# Altium schematic sheet schematic.SchDoc
size A4; SheetNumber: 1; SheetTotal: 1; SPICEModelCacheEHAOFZEF: <root> / <DocumentId>EHAOFZEF</DocumentId> / <CacheFrame Number="0"> / <Model Name="n7002" Kind="CKT"> / <Text>*---------- 2N7002 Spice Model ---------- / .SUBCKT N7002 10 20 30 / *     TERMINALS:  D  G  S / M1 1 2 3 3 NMOS L = 1E-006 W = 1E-006 / RD 10 1 0.976 / RS 30 3 0.001 / RG 20 2 160.6 / CGS 2 3 2E-011 / EGD 12 0 2 1 1 / VFB 14 0 0 / FFB 2 1 VFB 1 / CGD 13 14 5.9E-011 / R1 13 0 1 / D1 12 13 DLIM / DDG 15 14 DCGD / R2 12 15 1 / D2 15 0 DLIM / DSD 3 10 DSUB / .MODEL NMOS NMOS LEVEL = 3 VMAX = 1E+006 ETA = 0 VTO = 1.3 / + TOX = 6E-008 NSUB = 1E+016 KP = 0.4654 KAPPA = 1E-015 U0 = 400 / .MODEL DCGD D CJO = 1.2E-011 VJ = 0.6 M = 0.6 / .MODEL DSUB D IS = 6.808E-010 N = 1.576 RS = 0.1408 BV = 72 CJO = 8E-012 VJ = 0.8 M = 0.6474 / .MODEL DLIM D IS = 0.0001 / .ENDS</Text> / </Model> / <Model Name="2n2222" Kind="MDL"> / <Text>****** / * Spice Model / * Item: 2N2222 / * Date: 5/06/2014 / * Revision History: A / *========================================================== / * This model was developed by: / * Central Semiconductor Corp. / * 145 Adams Avenue / * Hauppauge, NY 11788 / * / * These models are subject to change without notice. / * Users may not directly or indirectly re-sell or / * re-distribute this model. This model may not / * be modified, or altered without the consent of Central Semiconductor Corp. / * / * For more information on this model contact / * Central Semiconductor Corp. at: / * (631) 435-1110 or Engineering@centralsemi.com / * http://www.centralsemi.com / *========================================================== / ****** / *SRC=2N2222;2N2222;BJTs NPN; Si;  60V  0.800A  250MHz   Central Semi Central Semi / .MODEL 2N2222  NPN (IS=2.20f NF=1.00 BF=240 VAF=114 / + IKF=0.293 ISE=2.73p NE=2.00 BR=4.00 NR=1.00 / + VAR=24.0 IKR=0.600 RE=0.194 RB=0.777 RC=77.7m / + XTB=1.5 CJE=24.9p VJE=1.10 MJE=0.500 CJC=12.4p VJC=0.300 / + MJC=0.300 TF=371p TR=64.0n EG=1.12 )</Text> / </Model> / <Model Name="led1" Kind="MDL"> / <Text>*Typ RED GaAs LED: Vf=1.7V Vr=4V If=40mA trr=3uS / *LED Pinout: 1=A, 2=K / .MODEL LED1 D (IS=93.2P RS=42M N=3.73 BV=4 IBV=10U / + CJO=2.97P VJ=.75 M=.333 TT=4.32U)</Text> / </Model> / <Model Name="vnse_0" Kind="CKT"> / <Text>.SUBCKT VNSE_0  1 2 / .PARAM FLW=10 / .PARAM NLF=80 / .PARAM NVR=35 / .PARAM GLF={PWR(FLW,0.25)*NLF/1164} / .PARAM RNV={1.184*PWR(NVR,2)} / .MODEL DVN D KF={PWR(FLW,0.5)/1E11} IS=1.0E-16 / I1 0 7 10E-3 / I2 0 8 10E-3 / D1 7 0 DVN / D2 8 0 DVN / E1 3 6 7 8 {GLF} / R1 3 0 1E9 / R2 3 0 1E9 / R3 3 6 1E9 / E2 6 4 5 0 10 / R4 5 0 {RNV} / R5 5 0 {RNV} / R6 3 4 1E9 / R7 4 0 1E9 / E3 1 2 3 4 1 / .ENDS</Text> / </Model> / <Model Name="phaserev_0" Kind="CKT"> / <Text>* / .SUBCKT PHASEREV_0  VCC VEE VIN+ VIN- VOUT+ VOUT- MID / E1 VOUT+ MID VALUE={IF(V(VIN+,MID)&lt;V(VEE,MID)-0.3,V(VCC,MID),V(VIN+,MID))} / E2 VOUT- MID VALUE={IF(V(VIN-,MID)&lt;V(VEE,MID)-0.3,V(VCC,MID),V(VIN-,MID))} / .ENDS</Text> / </Model> / <Model Name="crs_dist_0" Kind="CKT"> / <Text>.SUBCKT CRS_DIST_0  VIMON MID OUT / V1 VREF MID -40M / ESHF VSHF MID VIMON VREF 1 / GZC MID ZC VALUE = {SGN(V(VSHF,MID))} / R1 ZC MID 1 / C1 ZC MID 2U / GCR MID OUT VALUE = {IF((ABS(V(ZC,MID))&lt;=0.9),0,1)} / R2 OUT MID 1 / .ENDS</Text> / </Model> / <Model Name="vccs_lim_1_0" Kind="CKT"> / <Text>.SUBCKT VCCS_LIM_1_0  VC+ VC- IOUT+ IOUT- / .PARAM GAIN = 1E-4 / .PARAM IPOS = .5 / .PARAM INEG = -.5 / G1 IOUT+ IOUT- VALUE={LIMIT(GAIN*V(VC+,VC-),INEG,IPOS)} / .ENDS</Text> / </Model> / <Model Name="vccs_lim_zo_0" Kind="CKT"> / <Text>.SUBCKT VCCS_LIM_ZO_0  VC+ VC- IOUT+ IOUT- / .PARAM GAIN = 4E3 / .PARAM IPOS = 1E6 / .PARAM INEG = -1E6 / G1 IOUT+ IOUT- VALUE={LIMIT(GAIN*V(VC+,VC-),INEG,IPOS)} / .ENDS</Text> / </Model> / <Model Name="vccs_lim_2_en_0" Kind="CKT"> / <Text>.SUBCKT VCCS_LIM_2_EN_0  VC+ VC- IOUT+ IOUT- EN MID / .PARAM GAIN = 8.4E-4 / .PARAM IPOS = 0.005 / .PARAM INEG = -0.005 / G1 IOUT+ IOUT- VALUE={LIMIT(GAIN*V(EN,MID)*V(VC+,VC-),INEG,IPOS)} / .ENDS</Text> / </Model> / <Model Name="femt_0" Kind="CKT"> / <Text>.SUBCKT FEMT_0  1 2 / .PARAM FLWF=1E-3 / .PARAM NLFF=500 / .PARAM NVRF=500 / .PARAM GLFF={PWR(FLWF,0.25)*NLFF/1164} / .PARAM RNVF={1.184*PWR(NVRF,2)} / .MODEL DVNF D KF={PWR(FLWF,0.5)/1E11} IS=1.0E-16 / I1 0 7 10E-3 / I2 0 8 10E-3 / D1 7 0 DVNF / D2 8 0 DVNF / E1 3 6 7 8 {GLFF} / R1 3 0 1E9 / R2 3 0 1E9 / R3 3 6 1E9 / E2 6 4 5 0 10 / R4 5 0 {RNVF} / R5 5 0 {RNVF} / R6 3 4 1E9 / R7 4 0 1E9 / G1 1 2 3 4 1E-6 / .ENDS</Text> / </Model> / <Model Name="vccs_limit_iq_0" Kind="CKT"> / <Text>.SUBCKT VCCS_LIMIT_IQ_0  VC+ VC- IOUT+ IOUT- / .PARAM GAIN = 1E-3 / G1 IOUT- IOUT+ VALUE={IF( (V(VC+,VC-)&lt;=0),0,GAIN*V(VC+,VC-) )} / .ENDS</Text> / </Model> / <Model Name="clamp_amp_lo_0" Kind="CKT"> / <Text>.SUBCKT CLAMP_AMP_LO_0  VC+ VC- VIN COM VO+ VO- / .PARAM G=1 / GVO+ COM VO+ VALUE = {IF(V(VIN,COM)&gt;V(VC+,COM),((V(VIN,COM)-V(VC+,COM))*G),0)} / GVO- COM VO- VALUE = {IF(V(VIN,COM)&lt;V(VC-,COM),((V(VC-,COM)-V(VIN,COM))*G),0)} / .ENDS</Text> / </Model> / <Model Name="vccs_ext_lim_0" Kind="CKT"> / <Text>.SUBCKT VCCS_EXT_LIM_0  VIN+ VIN- IOUT- IOUT+ VP+ VP- / .PARAM GAIN = 1 / G1 IOUT+ IOUT- VALUE={LIMIT(GAIN*V(VIN+,VIN-),V(VP-,VIN-), V(VP+,VIN-))} / .ENDS</Text> / </Model> / <Model Name="clamp_amp_hi_0" Kind="CKT"> / <Text>.SUBCKT CLAMP_AMP_HI_0  VC+ VC- VIN COM VO+ VO- / .PARAM G=10 / GVO+ COM VO+ VALUE = {IF(V(VIN,COM)&gt;V(VC+,COM),((V(VIN,COM)-V(VC+,COM))*G),0)} / GVO- COM VO- VALUE = {IF(V(VIN,COM)&lt;V(VC-,COM),((V(VC-,COM)-V(VIN,COM))*G),0)} / .ENDS</Text> / </Model> / <Model Name="vccs_lim_gr_0" Kind="CKT"> / <Text>.SUBCKT VCCS_LIM_GR_0  VC+ VC- IOUT+ IOUT- / .PARAM GAIN = 1 / .PARAM IPOS = 0.013 / .PARAM INEG = -0.013 / G1 IOUT+ IOUT- VALUE={LIMIT(GAIN*V(VC+,VC-),INEG,IPOS)} / .ENDS</Text> / </Model> / <Model Name="vccs_lim_4_0" Kind="CKT"> / <Text>.SUBCKT VCCS_LIM_4_0  VC+ VC- IOUT+ IOUT- / .PARAM GAIN = 1 / .PARAM IPOS = 1.04 / .PARAM INEG = -1.04 / G1 IOUT+ IOUT- VALUE={LIMIT(GAIN*V(VC+,VC-),INEG,IPOS)} / .ENDS</Text> / </Model> / <Model Name="vccs_lim_claw+_0" Kind="CKT"> / <Text>.SUBCKT VCCS_LIM_CLAW+_0  VC+ VC- IOUT+ IOUT- / G1 IOUT+ IOUT- TABLE {ABS(V(VC+,VC-))} = / +(0, 1.17E-03) / +(0.0046251, 1.17E-3) / +(0.15716, 1.21E-3) / +(1.3309, 1.28E-3) / +(35.075, 2.12E-3) / +(35.680, 2.55E-3) / +(36.033, 2.84E-3) / +(37.416, 7.97E-3) / .ENDS</Text> / </Model> / <Model Name="vccs_lim_claw-_0" Kind="CKT"> / <Text>.SUBCKT VCCS_LIM_CLAW-_0  VC+ VC- IOUT+ IOUT- / G1 IOUT+ IOUT- TABLE {ABS(V(VC+,VC-))} = / +(0.010, 2.50E-5) / +(0.070, 2.50E-5) / +(0.090, 5.80E-4) / +(0.100, 6.06E-4) / +(0.760, 7.14E-4) / +(1.440, 7.62E-4) / +(8.000, 1.10E-3) / +(13.60, 1.55E-3) / +(15.45, 1.75E-3) / +(17.26, 2.15E-3) / +(18.87, 2.94E-3) / +(21.58, 4.50E-3) / +(25.53, 1.02E-2) / .ENDS</Text> / </Model> / <Model Name="vccs_lim_3_0" Kind="CKT"> / <Text>.SUBCKT VCCS_LIM_3_0  VC+ VC- IOUT+ IOUT- / .PARAM GAIN = 1 / .PARAM IPOS = 0.435 / .PARAM INEG = -0.435 / G1 IOUT+ IOUT- VALUE={LIMIT(GAIN*V(VC+,VC-),INEG,IPOS)} / .ENDS</Text> / </Model> / <Model Name="ol_sense_0" Kind="CKT"> / <Text>.SUBCKT OL_SENSE_0  COM SW+ OLN  OLP / GSW+ COM SW+ VALUE = {IF((V(OLN,COM)&gt;10E-3 | V(OLP,COM)&gt;10E-3),1,0)} / .ENDS</Text> / </Model> / <Model Name="lmx58_lm2904" Kind="CKT"> / <Text>* LMX58_LM2904 - Rev. B / * Created by Paul Goedeke; November 16, 2018 - Revised by GPAMPS Team; 2021-06-29 / * Created with Green-Williams-Lis Op Amp Macro-model Architecture / * Copyright 2018 by Texas Instruments Corporation / ****************************************************** / * MACRO-MODEL SIMULATED PARAMETERS: / ****************************************************** / * OPEN-LOOP GAIN AND PHASE VS. FREQUENCY  WITH RL, CL EFFECTS (Aol) / * UNITY GAIN BANDWIDTH (GBW) / * INPUT COMMON-MODE REJECTION RATIO VS. FREQUENCY (CMRR) / * POWER SUPPLY REJECTION RATIO VS. FREQUENCY (PSRR) / * DIFFERENTIAL INPUT IMPEDANCE (Zid) / * COMMON-MODE INPUT IMPEDANCE (Zic) / * OPEN-LOOP OUTPUT IMPEDANCE VS. FREQUENCY (Zo) / * OUTPUT CURRENT THROUGH THE SUPPLY (Iout) / * INPUT VOLTAGE NOISE DENSITY VS. FREQUENCY (en) / * INPUT CURRENT NOISE DENSITY VS. FREQUENCY (in) / * OUTPUT VOLTAGE SWING vs. OUTPUT CURRENT (Vo) / * SHORT-CIRCUIT OUTPUT CURRENT (Isc) / * QUIESCENT CURRENT (Iq) / * SETTLING TIME VS. CAPACITIVE LOAD (ts) / * SLEW RATE (SR) / * SMALL SIGNAL OVERSHOOT VS. CAPACITIVE LOAD / * LARGE SIGNAL RESPONSE / * OVERLOAD RECOVERY TIME (tor) / * INPUT BIAS CURRENT (Ib) / * INPUT OFFSET CURRENT (Ios) / * INPUT OFFSET VOLTAGE (Vos) / * INPUT COMMON-MODE VOLTAGE RANGE (Vcm) / * INPUT OFFSET VOLTAGE VS. INPUT COMMON-MODE VOLTAGE (Vos vs. Vcm) / * INPUT/OUTPUT ESD CELLS (ESDin, ESDout) / ****************************************************** / .subckt LMX58_LM2904 IN+ IN- VCC VEE OUT / ****************************************************** / * MODEL DEFINITIONS: / .model BB_SW VSWITCH(Ron=50 Roff=1e12 Von=700e-3 Voff=0) / .model ESD_SW VSWITCH(Ron=50 Roff=1e12 Von=250e-3 Voff=0) / .model OL_SW VSWITCH(Ron=1e-3 Roff=1e9 Von=900e-3 Voff=800e-3) / .model OR_SW VSWITCH(Ron=10e-3 Roff=1e9 Von=1e-3 Voff=0) / .model R_NOISELESS RES(T_ABS=-273.15) / ****************************************************** / I_OS        ESDn MID -18N / I_B         37 MID -20N / V_GRp       57 MID 180 / V_GRn       58 MID -180 / V_ISCp      51 MID 40 / V_ISCn      52 MID -40 / V_ORn       45 VCLP -1.2 / V11         56 44 0 / V_ORp       43 VCLP 1.2 / V12         55 42 0 / V4          33 OUT 0 / VCM_MIN     79 VEE_B 0 / VCM_MAX     80 VCC_B -1.5 / I_Q         VCC VEE 350U / V_OS        86 37 1.8M / R61         MID 22 R_NOISELESS 8.001K / C16         22 23 19.89P / R58         23 22 R_NOISELESS 100MEG / GVCCS2      23 MID VEE_B MID  -992.9M / R57         MID 23 R_NOISELESS 1 / XU3         VCC_B VEE_B 24 25 26 27 MID PHASEREV_0 / XU1         VIMON MID CRS CRS_DIST_0 / C21         28 29 313.8N / C22         30 31 636.6F / R70         31 MID R_NOISELESS 2.5 / R67         31 30 R_NOISELESS 10K / R66         30 MID R_NOISELESS 1 / XU2         31 MID MID 32 VCCS_LIM_ZO_0 / GVCCS4      30 MID 29 MID  -4.3 / R65         29 MID R_NOISELESS 3.03K / R64         29 28 R_NOISELESS 10K / R63         28 MID R_NOISELESS 1 / GVCCS3      28 MID CL_CLAMP 33  -90 / R62         32 MID R_NOISELESS 1 / C29         34 MID 72F / R78         MID 34 R_NOISELESS 1MEG / GVCCS9      34 MID 35 MID  -1U / XU5         36 MID MID CLAMP CRS MID VCCS_LIM_2_EN_0 / C28         38 MID 1P / R77         39 38 R_NOISELESS 100 / C27         40 MID 1P / R76         41 40 R_NOISELESS 100 / R75         MID 42 R_NOISELESS 1 / GVCCS8      42 MID 43 MID  -1 / R74         44 MID R_NOISELESS 1 / GVCCS7      44 MID 45 MID  -1 / Xi_nn       ESDn MID FEMT_0 / Xi_np       MID 37 FEMT_0 / Xe_n        ESDp 37 VNSE_0 / C25         35 MID 72F / R69         MID 35 R_NOISELESS 1MEG / GVCCS6      35 MID VSENSE MID  -1U / C20         CLAMP MID 13.5N / R68         MID CLAMP R_NOISELESS 1MEG / R44         MID 36 R_NOISELESS 1MEG / XVCCS_LIM_1 46 27 MID 36 VCCS_LIM_1_0 / Rdummy      MID 33 R_NOISELESS 25K / Rx          33 32 R_NOISELESS 250K / R56         MID 47 R_NOISELESS 1K / C15         47 48 1.592P / R55         48 47 R_NOISELESS 100MEG / GVCCS1      48 MID VCC_B MID  -100M / R54         MID 48 R_NOISELESS 1 / R49         MID 49 R_NOISELESS 4.616K / C14         49 50 26.53P / R48         50 49 R_NOISELESS 100MEG / G_adjust    50 MID ESDp MID  -685.2M / Rsrc        MID 50 R_NOISELESS 1 / XIQPos      VIMON MID MID VCC VCCS_LIMIT_IQ_0 / XIQNeg      MID VIMON VEE MID VCCS_LIMIT_IQ_0 / C_DIFF      ESDp ESDn 1P / XCL_AMP     51 52 VIMON MID 53 54 CLAMP_AMP_LO_0 / SOR_SWp     CLAMP 55 CLAMP 55  S_VSWITCH_1 / SOR_SWn     56 CLAMP 56 CLAMP  S_VSWITCH_2 / XGR_AMP     57 58 59 MID 60 61 CLAMP_AMP_HI_0 / R39         57 MID R_NOISELESS 1T / R37         58 MID R_NOISELESS 1T / R42         VSENSE 59 R_NOISELESS 1M / C19         59 MID 1F / R38         60 MID R_NOISELESS 1 / R36         MID 61 R_NOISELESS 1 / R40         60 62 R_NOISELESS 1M / R41         61 63 R_NOISELESS 1M / C17         62 MID 1F / C18         MID 63 1F / XGR_SRC     62 63 CLAMP MID VCCS_LIM_GR_0 / R21         53 MID R_NOISELESS 1 / R20         MID 54 R_NOISELESS 1 / R29         53 64 R_NOISELESS 1M / R30         54 65 R_NOISELESS 1M / C9          64 MID 1F / C8          MID 65 1F / XCL_SRC     64 65 CL_CLAMP MID VCCS_LIM_4_0 / R22         51 MID R_NOISELESS 1T / R19         MID 52 R_NOISELESS 1T / XCLAWp      VIMON MID 66 VCC_B VCCS_LIM_CLAW+_0 / XCLAWn      MID VIMON VEE_B 67 VCCS_LIM_CLAW-_0 / R12         66 VCC_B R_NOISELESS 1K / R16         66 68 R_NOISELESS 1M / R13         VEE_B 67 R_NOISELESS 1K / R17         69 67 R_NOISELESS 1M / C6          69 MID 1F / C5          MID 68 1F / G2          VCC_CLP MID 68 MID  -1M / R15         VCC_CLP MID R_NOISELESS 1K / G3          VEE_CLP MID 69 MID  -1M / R14         MID VEE_CLP R_NOISELESS 1K / XCLAW_AMP   VCC_CLP VEE_CLP VOUT_S MID 70 71 CLAMP_AMP_LO_0 / R26         VCC_CLP MID R_NOISELESS 1T / R23         VEE_CLP MID R_NOISELESS 1T / R25         70 MID R_NOISELESS 1 / R24         MID 71 R_NOISELESS 1 / R27         70 72 R_NOISELESS 1M / R28         71 73 R_NOISELESS 1M / C11         72 MID 1F / C10         MID 73 1F / XCLAW_SRC   72 73 CLAW_CLAMP MID VCCS_LIM_3_0 / H2          41 MID V11 -1 / H3          39 MID V12 1 / C12         SW_OL MID 100P / R32         74 SW_OL R_NOISELESS 100 / R31         74 MID R_NOISELESS 1 / XOL_SENSE   MID 74 40 38 OL_SENSE_0 / S1          28 29 SW_OL MID  S_VSWITCH_3 / H1          75 MID V4 1K / S7          VEE OUT VEE OUT  S_VSWITCH_4 / S6          OUT VCC OUT VCC  S_VSWITCH_5 / R11         MID 76 R_NOISELESS 1T / R18         76 VOUT_S R_NOISELESS 100 / C7          VOUT_S MID 10P / E5          76 MID OUT MID  1 / C13         VIMON MID 10P / R33         75 VIMON R_NOISELESS 100 / R10         MID 75 R_NOISELESS 1T / R47         77 VCLP R_NOISELESS 100 / C24         VCLP MID 100P / E4          77 MID CL_CLAMP MID  1 / R46         MID CL_CLAMP R_NOISELESS 1K / G9          CL_CLAMP MID CLAW_CLAMP MID  -1M / R45         MID CLAW_CLAMP R_NOISELESS 1K / G8          CLAW_CLAMP MID 34 MID  -1M / R43         MID VSENSE R_NOISELESS 1K / G15         VSENSE MID CLAMP MID  -1M / C4          46 MID 1F / R9          46 78 R_NOISELESS 1M / R7          MID 79 R_NOISELESS 1T / R6          80 MID R_NOISELESS 1T / R8          MID 78 R_NOISELESS 1 / XVCM_CLAMP  26 MID 78 MID 80 79 VCCS_EXT_LIM_0 / E1          MID 0 81 0  1 / R89         VEE_B 0 R_NOISELESS 1 / R5          82 VEE_B R_NOISELESS 1M / C3          82 0 1F / R60         81 82 R_NOISELESS 1MEG / C1          81 0 100e-9 / R3          81 0 R_NOISELESS 1T / R59         83 81 R_NOISELESS 1MEG / C2          83 0 1F / R4          VCC_B 83 R_NOISELESS 1M / R88         VCC_B 0 R_NOISELESS 1 / G17         VEE_B 0 VEE 0  -1 / G16         VCC_B 0 VCC 0  -1 / R_PSR       84 24 R_NOISELESS 1K / G_PSR       24 84 47 22  -1M / R2          25 ESDn R_NOISELESS 1M / R1          84 85 R_NOISELESS 1M / R_CMR       86 85 R_NOISELESS 1K / G_CMR       85 86 49 MID  -1M / C_CMn       ESDn MID 2P / C_CMp       MID ESDp 2P / R53         ESDn MID R_NOISELESS 1T / R52         MID ESDp R_NOISELESS 1T / R35         IN- ESDn R_NOISELESS 10M / R34         IN+ ESDp R_NOISELESS 10M / .MODEL S_VSWITCH_1 VSWITCH (RON=10M ROFF=1T VON=10M VOFF=0) / .MODEL S_VSWITCH_2 VSWITCH (RON=10M ROFF=1T VON=10M VOFF=0) / .MODEL S_VSWITCH_3 VSWITCH (RON=1M ROFF=1T VON=500M VOFF=100M) / .MODEL S_VSWITCH_4 VSWITCH (RON=50 ROFF=1T VON=500M VOFF=450M) / .MODEL S_VSWITCH_5 VSWITCH (RON=50 ROFF=1T VON=500M VOFF=450M) / .ENDS LMX58_LM2904</Text> / <Dependency>0\vnse_0</Dependency> / <Dependency>0\phaserev_0</Dependency> / <Dependency>0\crs_dist_0</Dependency> / <Dependency>0\vccs_lim_1_0</Dependency> / <Dependency>0\vccs_lim_zo_0</Dependency> / <Dependency>0\vccs_lim_2_en_0</Dependency> / <Dependency>0\femt_0</Dependency> / <Dependency>0\vccs_limit_iq_0</Dependency> / <Dependency>0\clamp_amp_lo_0</Dependency> / <Dependency>0\vccs_ext_lim_0</Dependency> / <Dependency>0\clamp_amp_hi_0</Dependency> / <Dependency>0\vccs_lim_gr_0</Dependency> / <Dependency>0\vccs_lim_4_0</Dependency> / <Dependency>0\vccs_lim_claw+_0</Dependency> / <Dependency>0\vccs_lim_claw-_0</Dependency> / <Dependency>0\vccs_lim_3_0</Dependency> / <Dependency>0\ol_sense_0</Dependency> / </Model> / <Model Name="led3" Kind="MDL"> / <Text>*Typ BLUE SiC LED: Vf=3.4V Vr=5V If=40mA trr=3uS / *LED Pinout: 1=A, 2=K / .MODEL LED3 D (IS=93.1P RS=42M N=7.47 BV=5 IBV=30U / + CJO=2.97P VJ=.75 M=.333 TT=4.32U)</Text> / </Model> / <Model Name="bs170" Kind="CKT"> / <Text>.SUBCKT BS170 1 2 3 / * 1=drain  2=gate  3=source / Cgs  2 3 12.3E-12 / Cgd1 2 4 27.4E-12 / Cgd2 1 4 6E-12 / M1 1 2 3 3 MOST1 / M2 4 2 1 3 MOST2 / D1 3 1 Dbody / .MODEL MOST1 NMOS(Level=3 Kp=20.78u W=9.7m L=2u Rs=20m Vto=2 Rd=1.186) / .MODEL MOST2 NMOS(VTO=-4.73 Kp=20.78u W=9.7m L=2u Rs=20m) / .MODEL Dbody D(Is=125f N=1.023 Rs=1.281 Ikf=18.01 Cjo=46.3p M=.3423 / +            Vj=.4519 Bv=60 Ibv=10u Tt=161.6n) / .ENDS</Text> / </Model> / <Model Name="npn" Kind="MDL"> / <Text>*Default NPN BJT / *NPN Trans Pinout: C,B,E / .MODEL NPN NPN()</Text> / </Model> / </CacheFrame> / </root>
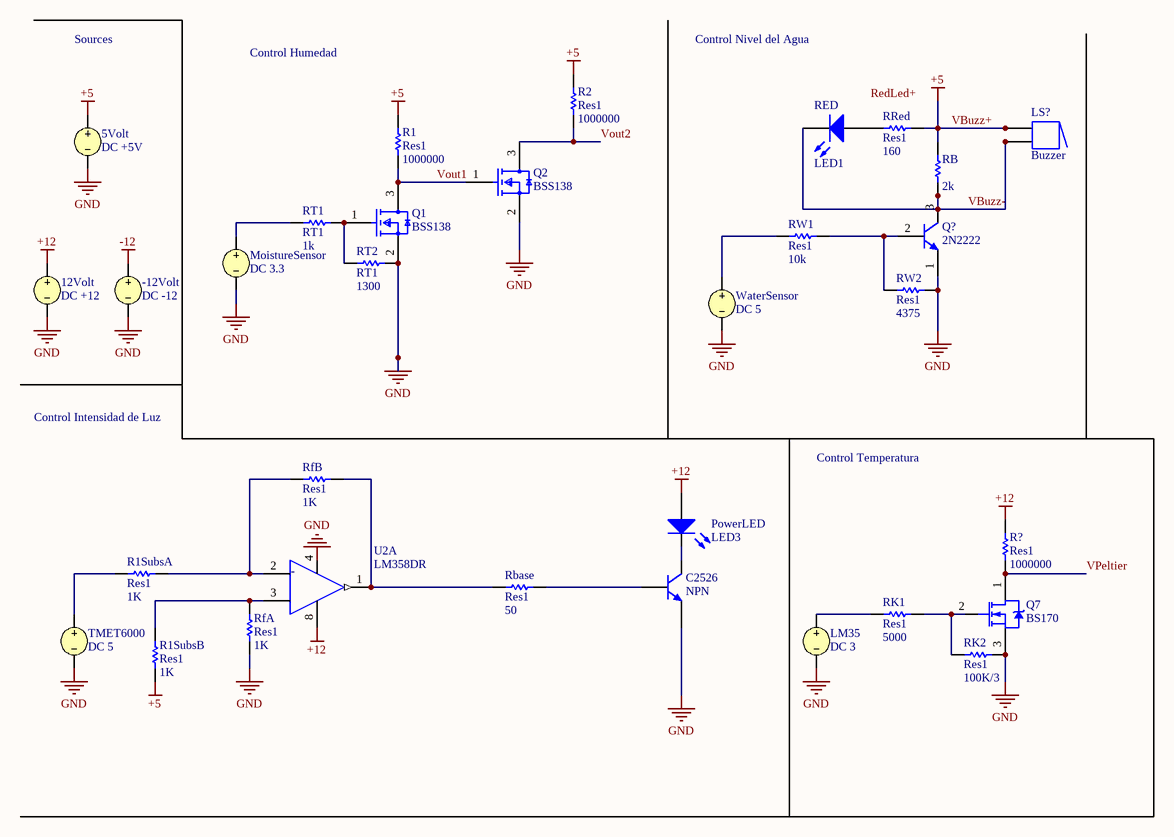
[diagram p0: schematic.SchDoc]

## Parts
5Volt  DC +5V
12Volt  DC +12
-12Volt  DC -12
C2526  NPN  [TO-226-AA]
LM35  DC 3
LS?  Buzzer  [ABSM-1574]
MoistureSensor  DC 3.3
PowerLED  LED3  [3.5X2.8X1.9]
Q1  BSS138  [FP-318-08-IPC_B]
Q2  BSS138  [FP-318-08-IPC_B]
Q7  BS170  [ONSC-TO-92-3-29-11]
Q?  2N2222  [MLTC-TO-18-3]
R1  Res1  value 1000000  [AXIAL-0.3]
R1SubsA  Res1  value 1K  [AXIAL-0.3]
R1SubsB  Res1  value 1K  [AXIAL-0.3]
R2  Res1  value 1000000  [AXIAL-0.3]
R?  Res1  value 1000000  [AXIAL-0.3]
RB  value 2k  [AXIAL-0.3]
Rbase  Res1  value 50  [AXIAL-0.3]
RED  LED1  [LED-1]
RfA  Res1  value 1K  [AXIAL-0.3]
RfB  Res1  value 1K  [AXIAL-0.3]
RK1  Res1  value 5000  [AXIAL-0.3]
RK2  Res1  value 100K/3  [AXIAL-0.3]
RRed  Res1  value 160  [AXIAL-0.3]
RT1  RT1  value 1k  [AXIAL-0.3]
RT2  RT1  value 1300  [AXIAL-0.3]
RW1  Res1  value 10k  [AXIAL-0.3]
RW2  Res1  value 4375  [AXIAL-0.3]
TMET6000  DC 5
U2  LM358DR  [FP-D0008A-MFG]  (part A of 2)
WaterSensor  DC 5

## Nets
+12: 12Volt.1 PowerLED.1(A) R?.2 U2.8(V+)
-12: -12Volt.1
GND: 5Volt.2 12Volt.2 -12Volt.2 C2526.3(E) LM35.2 MoistureSensor.2 Q1.2(S) Q2.2(S) Q7.3(S) Q?.1(E) RfA.1 RK2.2 RT2.1 RW2.2 TMET6000.2 WaterSensor.2
VBuzz+: 5Volt.1 LS?.1 LS?.1A R1.2 R1SubsB.1 R2.2 RB.1 RRed.2  [also labelled +5]
VBuzz-: LS?.2 LS?.2A Q?.3(C) RB.2 RED.2(K)
Vout1: Q1.3(D) Q2.1(G) R1.1
Vout2: Q2.3(D) R2.1
VPeltier: Q7.1(D) R?.1
NetC2526_1: C2526.1(C) PowerLED.2(K)
NetC2526_2: C2526.2(B) Rbase.2
NetLM35_1: LM35.1 RK1.1
NetMoistureSensor_1: MoistureSensor.1 RT1.2
NetQ1_1: Q1.1(G) RT1.1 RT2.2
NetQ7_2: Q7.2(G) RK1.2 RK2.1
NetQ?_2: Q?.2(B) RW1.2 RW2.1
NetR1SubsA_1: R1SubsA.1 TMET6000.1
NetR1SubsA_2: R1SubsA.2 RfB.2 U2.2(IN1-)
NetR1SubsB_2: R1SubsB.2 RfA.2 U2.3(IN1+)
NetRbase_1: Rbase.1 RfB.1 U2.1(1OUT)
NetRED_1: RED.1(A) RRed.1
NetRW1_1: RW1.1 WaterSensor.1

Not connected (* = marked no-connect by the designer): U2 4(V-)

## Notes on the sheet
- Sources
- Control Humedad
- Control Nivel del Agua
- Control Intensidad de Luz
- Control Temperatura
- Labels drawn without touching a wire or pin: GND, RedLed+
- (in symbol CMP-1685-00009-2, part A) -

## Library data of the parts
5Volt 12Volt -12Volt = VSRC: Voltage Source; Note: PCB Footprint - Not required; Published: 8-Jun-2000; LatestRevisionDate: 17-Jul-2002; LatestRevisionNote: Re-released for DXP Platform.; PackageReference: Not Applicable; Publisher: Altium Limited
  5Volt: Value: +5V
  12Volt: Value: +12
  -12Volt: Value: -12
C2526 = NPN: NPN Bipolar Transistor; Published: 8-Jun-2000; LatestRevisionDate: 17-Jul-2002; LatestRevisionNote: Re-released for DXP Platform.; PackageReference: TO-226-AA; Publisher: Altium Limited; PackageDescription: TO, Flat Index; 3 In-Line, Axial Leads; Body Dia. 4.8mm; Leads 0.55 x 0.51 mm (max); Code_JEDEC: TO-226-AA
LM35 = VSRC: Voltage Source; Note: PCB Footprint - Not required; Value: 3; Published: 8-Jun-2000; LatestRevisionDate: 17-Jul-2002; LatestRevisionNote: Re-released for DXP Platform.; PackageReference: Not Applicable; Publisher: Altium Limited
LS? = Buzzer: Magnetic Transducer Buzzer; Published: 24-Mar-1999; LatestRevisionDate: 17-Dec-2003; LatestRevisionNote: Schematic revised, PCB Footprint replaced.; DatasheetVersion: 17-Dec-2003; PackageReference: ABSM-1574; Publisher: Altium Limited; PackageDescription: Magnetic Transducer Buzzer; ComponentLink1Description: Manufacturer Link; ComponentLink1URL: http://www.megastar.com/linecard/buzzmode/index.php
MoistureSensor = VSRC: Voltage Source; Note: PCB Footprint - Not required; Value: 3.3; Published: 8-Jun-2000; LatestRevisionDate: 17-Jul-2002; LatestRevisionNote: Re-released for DXP Platform.; PackageReference: Not Applicable; Publisher: Altium Limited
PowerLED = LED3: Typical BLUE SiC LED; Published: 8-Jun-2000; LatestRevisionDate: 17-Dec-2003; LatestRevisionNote: PCB Footprint replaced.; DatasheetVersion: 16-Apr-2002; PackageVersion: 16-Apr-2002; PackageReference: 3.5X2.8X1.9; Publisher: Altium Limited; PackageDescription: SM LED; 2 C-Bend Leads; Body 3.5 x 2.8 x 1.9 mm, inc leads (LxWxH typ)
Q1 Q2 = CMP-07173-000101-1: MOSFET N-CH 50V 220MA SOT-23; Turn-Off Delay Time: 20ns; Element Configuration: Single; Rds On Max: 3.5R; Gate to Source Voltage (Vgs): 20V; Threshold Voltage: 1.3V; Number of Elements: 1; Power Dissipation: 360mW; Rise Time: 9ns; Turn-On Delay Time: 2.5ns; Input Capacitance: 27pF; On-State Resistance: 6R; Lead Free: Lead Free; Length: 2.92mm; Width: 1.3mm; Drain to Source Breakdown Voltage: 50V; Min Operating Temperature: -55°C; REACH SVHC: No SVHC; Packaging: Tape and Reel; Radiation Hardening: No; Height: 0.93mm; Drain to Source Voltage (Vdss): 50V; Current Rating: 220mA; Voltage Rating (DC): 50V; Weight: 0.03g; Continuous Drain Current (ID): 220mA; Number of Pins: 3; Nominal Vgs: 1.3V; Max Power Dissipation: 360mW; Fall Time: 9ns; Drain to Source Resistance: 3.5R; Contact Plating: Tin; Case/Package: SOT-23; Package Quantity: 1; Dual Supply Voltage: 50V; Mount: Surface Mount; Termination: SMD/SMT; Max Operating Temperature: 150°C
Q7 = CMP-1058-00929-1: Small Signal MOSFET, 500 mA, 60 V, N-Channel, 3-Pin TO-92, Bulk Box; Manufacturer: On Semiconductor; VGS Max (V): 20; Configuration: Single; PD Max (W): 0.35; VGS(th) Max (V): 3; ID Max (A): 0.5; V(BR)DSS Min (V): 60; Channel Polarity: N Channel; PackageDescription: 3-Pin Transistor Outline, Body 4.825 x 3.685 mm, Pitch 1.27 mm; Package Type: TO-92; ComponentLink1Description: Manufacturer URL; ComponentLink1URL: http://www.onsemi.com/; DatasheetVersion: Rev. 6; ComponentLink3Description: Package Specification; PartNumber: BS170; ComponentLink2URL: http://www.onsemi.com/pub_link/Collateral/BS170-D.PDF; PackageVersion: Rev. AM; Mounting Technology: Through Hole; PackageReference: TO-92-3-29-11_AM_SL; ComponentLink2Description: Datasheet; ComponentLink3URL: http://www.onsemi.cn/pub_link/Collateral/2N6426-D.PDF; Packing: Bulk Box
Q? = CMP-2000-05237-1: Low Power Bipolar NPN Transistor, 30 V, -65 to 200 degC, 3-Pin TO-18, RoHS, Bulk; Manufacturer: Multicomp; Pin Configuration: a; No. of Pins: 3; No. of Transistors: 1; Collector Emitter Voltage Vces: 400mV; Current Ic Continuous a Max: 800mA; Power Dissipation Pd: 500mW; Collector Emitter Voltage V(br)ceo: 30V; Gain Bandwidth ft Typ: 250MHz; Voltage Vcbo: 60V; DC Current Gain hFE: 100; Full Power Rating Temperature: 25degC; Current Ic @ Vce Sat: 150mA; SVHC: NoSVHC(19-Dec-2012); Package Reference: TO-18-3; Package Description: 3-Pin Transistor Outline Package (TO-18), Dia 5.54 mm, Pitch Pitch 1.485mm; Datasheet URL: http://www.farnell.com/datasheets/1662272.pdf; Transistor Case Style: TO-18; Continuous Collector Current Ic Max: 800mA; Manufacturer URL: http://uk.farnell.com/b/multicomp; DC Collector Current: 800mA; Hfe Min: 100; Transistor Polarity: NPN; Power Dissipation Ptot Max: 500mW; Package / Case: TO-18; Datasheet Version: Rev. 1.1, 05/2012; Gain Bandwidth ft Min: 250MHz; Current Ic hFE: 150mA
R1 R1SubsA R1SubsB R2 R? RB Rbase RfA RfB RK1 RK2 RRed RT1 RT2 RW1 RW2 = Res1: Resistor; Published: 8-Jun-2000; LatestRevisionDate: 17-Jul-2002; LatestRevisionNote: Re-released for DXP Platform.; PackageReference: AXIAL-0.3; Publisher: Altium Limited; PackageDescription: Axial Device, Thru-Hole; 2 Leads; 0.3 in Pin Spacing
RED = LED1: Typical RED GaAs LED; Published: 8-Jun-2000; LatestRevisionDate: 08-Jul-2005; LatestRevisionNote: Mech Layer 1 removed.; PackageReference: LED-1; Publisher: Altium Limited; PackageDescription: LED; 2 Leads
TMET6000 WaterSensor = VSRC: Voltage Source; Note: PCB Footprint - Not required; Value: 5; Published: 8-Jun-2000; LatestRevisionDate: 17-Jul-2002; LatestRevisionNote: Re-released for DXP Platform.; PackageReference: Not Applicable; Publisher: Altium Limited
U2 = CMP-1685-00009-2: IC OPAMP GP 2 CIRCUIT 8SOIC; Output Current: 30mA; Min Dual Supply Voltage: 1.5V; Input Offset Voltage (Vos): 7mV; Power Supply Rejection Ratio (PSRR): 65dB; Unity Gain Bandwidth Product: 700kHz; Number of Channels: 2; Min Supply Voltage: 3V; Max Dual Supply Voltage: 16V; Dual Supply Voltage: 9V; Max Supply Voltage: 32V; Nominal Supply Current: 1.2mA; Slew Rate: 0.3V/µs; Input Bias Current: 250nA; Voltage Gain: 100dB; Operating Supply Current: 1mA; REACH SVHC: No SVHC; Package Quantity: 2500; Width: 3.91mm; Max Operating Temperature: 70°C; Min Operating Temperature: 0°C; Mount: Surface Mount; Length: 4.9mm; Radiation Hardening: No; Case/Package: SOIC; Lead Free: Lead Free; Number of Elements: 2; Packaging: Tape and Reel; Output Current per Channel: 30mA; Number of Circuits: 2; Bandwidth: 700kHz; Operating Supply Voltage: 16V; Gain Bandwidth Product: 700kHz; Number of Pins: 8; Number of Amplifiers: 2; Height: 1.58mm; Common Mode Rejection Ratio: 65dB; Contact Plating: Gold